# Altium schematic sheet imu.SchDoc
size A
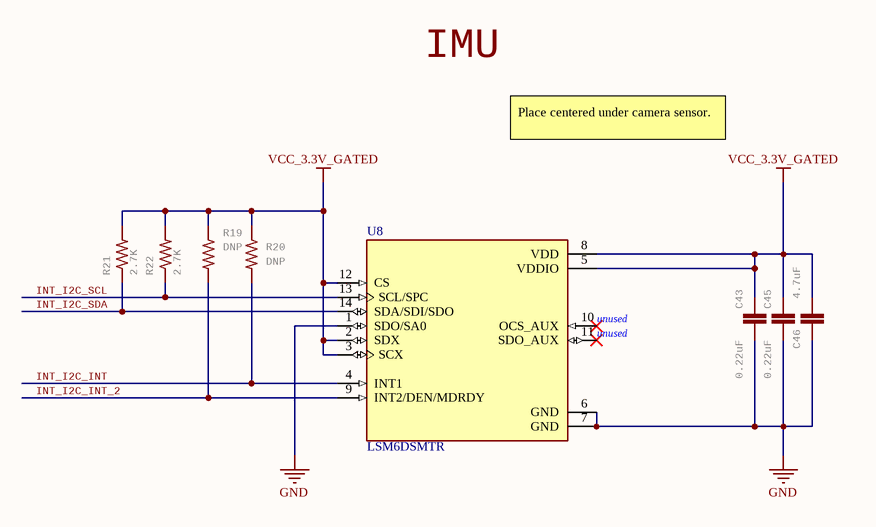
[diagram p0: imu.SchDoc]

## Parts
C43  0.22uF  [C0201]
C45  0.22uF  [C0201]
C46  4.7uF  [0402-CAP]
R19  DNP  [0402-RES]
R20  DNP  [0402-RES]
R21  2.7K  [0402-RES]
R22  2.7K  [0402-RES]
U8  LSM6DSMTR  [LSM6DSMTR]

## Nets
GND: C43.2 C45.2 C46.1 U8.1(SDO/SA0) U8.6(GND) U8.7(GND)
VCC_3.3V_GATED: C43.1 C45.1 C46.2 R19.1 R20.1 R21.2 R22.2 U8.2(SDX) U8.3(SCX) U8.5(VDDIO) U8.8(VDD) U8.12(CS)
INT_I2C_INT: R20.2 U8.4(INT1)
INT_I2C_INT_2: R19.2 U8.9(INT2/DEN/MDRDY)
INT_I2C_SCL: R22.1 U8.13(SCL/SPC)
INT_I2C_SDA: R21.1 U8.14(SDA/SDI/SDO)

Not connected (* = marked no-connect by the designer): U8 10(OCS_AUX)* 11(SDO_AUX)*

## Notes on the sheet
- IMU
- Place centered under camera sensor.
- (near U8) unused

## Library data of the parts
C43 C45 = C-EUC0201: CAPACITOR, European symbol; MPN: GRM033R60J224ME15D; GateName_1: G$1; SymbolName_1: C-EU; POPULARITY: 0; DeviceName: C0201; LibraryName: rcl; DeviceSetName: C-EU; SPICEPREFIX: C; Part Number: GRM033R60J224ME15D
C46 = CAP0402-CAP: CapacitorStandard 0603 ceramic capacitor, and 0.1" leaded capacitor.; MPN: JMK105BBJ475MV-F; GateName_1: G$1; SymbolName_1: CAP; DeviceName: 0402-CAP; LibraryName: sfe; DeviceSetName: CAP; Part Number: JMK105BBJ475MV-F
R19 R20 = RESISTOR0402-RES: ResistorBasic schematic elements and footprints for 0603, 1206, and PTH resistors.; GateName_1: G$1; SymbolName_1: RESISTOR; DeviceName: 0402-RES; LibraryName: sfe; DeviceSetName: RESISTOR; MPN: DNP; Part Number: DNP
R21 R22 = RESISTOR0402-RES: ResistorBasic schematic elements and footprints for 0603, 1206, and PTH resistors.; MPN: AC0402JR-072K7L; GateName_1: G$1; SymbolName_1: RESISTOR; DeviceName: 0402-RES; LibraryName: sfe; DeviceSetName: RESISTOR; Part Number: AC0402JR-072K7L
U8 = LSM6DSMTR: Accelerometer, Gyroscope, Temperature, 6 Axis Sensor IÂ²C, SPI Output; MF: STMicroelectronics; Design Item ID: LSM6DSMTR; Package: VFLGA-14 STMicroelectronics; Component Type: Standard; Price: None; Value: *; Pin Count: 14; SnapEDA_Link: https://www.snapeda.com/parts/LSM6DSMTR/STMicroelectronics/view-part/581716/?ref=snap; Availability: Unavailable; Source: SnapEDAsch.SchLib; MP: LSM6DSMTR; MPN: LSM6DSMTR; Part Number: LSM6DSMTR